# Altium project FOdriver_V2.0.PrjPcb
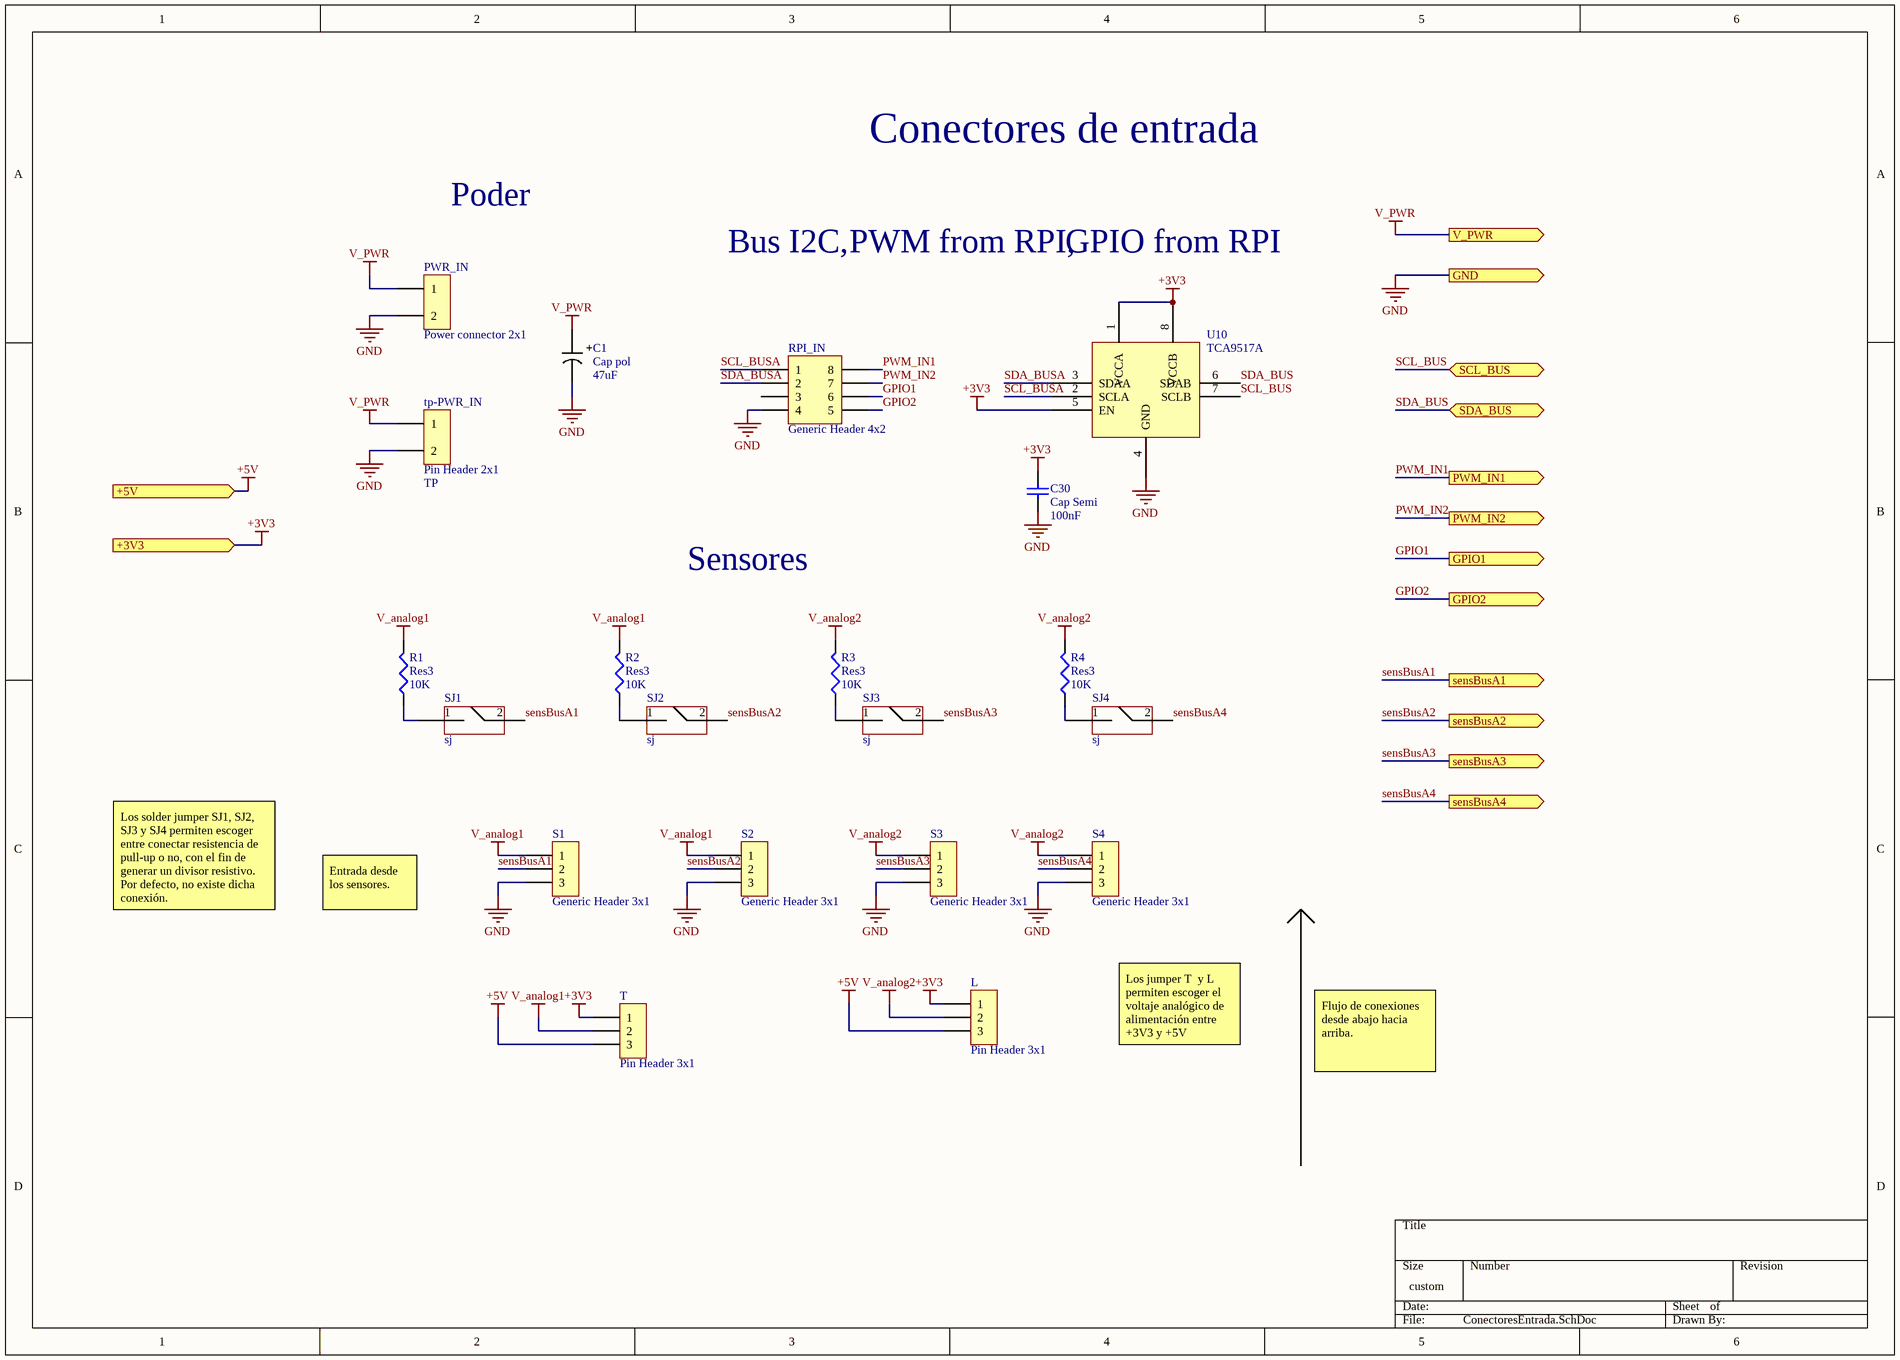
[diagram p0: ConectoresEntrada.SchDoc]
6 sheets, 191 parts. Net scope: hierarchical (ports join the sheet entries above them; power ports are global).
Board file: PCBV2.PcbDoc
Sheets:
  ConectoresEntrada.SchDoc
  DCDC_stepdown.SchDoc
  genPWM.SchDoc
  HighCurrentDriver.SchDoc
  ADC.SchDoc
    1 = analogPath.SchDoc
    2 = analogPath.SchDoc
    3 = analogPath.SchDoc
    4 = analogPath.SchDoc

## Sheet ConectoresEntrada.SchDoc
size 355 x 254 mm; DrawnBy: Constanza Barriga

### Parts
C1  Cap pol  value 47uF  [CAP_SMD_Electrolytic_10x10]
C30  Cap Semi  value 100nF  [1608[0603]]
L  Pin Header 3x1  [HDR-TH_3P-P2.54-V]
PWR_IN  Power connector 2x1  [CONN-TH_430450212]
R1  Res3  value 10K  [J1-0603]
R2  Res3  value 10K  [J1-0603]
R3  Res3  value 10K  [J1-0603]
R4  Res3  value 10K  [J1-0603]
RPI_IN  Generic Header 4x2  [CONN-TH_8P-P2.54-V-M_15477608]
S1  Generic Header 3x1  [CONN-TH_A2547WV-3P]
S2  Generic Header 3x1  [CONN-TH_A2547WV-3P]
S3  Generic Header 3x1  [CONN-TH_A2547WV-3P]
S4  Generic Header 3x1  [CONN-TH_A2547WV-3P]
SJ1  sj  [SJ2]
SJ2  sj  [SJ2]
SJ3  sj  [SJ2]
SJ4  sj  [SJ2]
T  Pin Header 3x1  [HDR-TH_3P-P2.54-V]
tp-PWR_IN  Pin Header 2x1  [HDR-TH_P2.54-H-M_A2541WV-2P]
U10  TCA9517A  [VSSOP - 8]

### Ports
+3V3 (in), +5V (in), GND (out), GPIO1 (out), GPIO2 (out), PWM_IN1 (out), PWM_IN2 (out), SCL_BUS (bidir), SDA_BUS (bidir), sensBusA1 (out), sensBusA2 (out), sensBusA3 (out), sensBusA4 (out), V_PWR (out)

### Nets
+3V3: C30.2 L.1 T.1 U10.1(VCCA) U10.5(EN) U10.8(VCCB) ; port +3V3
+5V: L.3 T.3 ; port +5V
GND: C1.1 C30.1 PWR_IN.2 RPI_IN.4 S1.3 S2.3 S3.3 S4.3 tp-PWR_IN.2 U10.4(GND) ; port GND
V_analog1: R1.2 R2.2 S1.1 S2.1 T.2
V_analog2: L.2 R3.2 R4.2 S3.1 S4.1
V_PWR: C1.2 PWR_IN.1 tp-PWR_IN.1 ; port V_PWR
GPIO1: RPI_IN.6 ; port GPIO1
GPIO2: RPI_IN.5 ; port GPIO2
PWM_IN1: RPI_IN.8 ; port PWM_IN1
PWM_IN2: RPI_IN.7 ; port PWM_IN2
SCL_BUS: U10.7(SCLB) ; port SCL_BUS
SCL_BUSA: RPI_IN.1 U10.2(SCLA)
SDA_BUS: U10.6(SDAB) ; port SDA_BUS
SDA_BUSA: RPI_IN.2 U10.3(SDAA)
sensBusA1: S1.2 SJ1.2 ; port sensBusA1
sensBusA2: S2.2 SJ2.2 ; port sensBusA2
sensBusA3: S3.2 SJ3.2 ; port sensBusA3
sensBusA4: S4.2 SJ4.2 ; port sensBusA4
NetR1_1: R1.1 SJ1.1
NetR2_1: R2.1 SJ2.1
NetR3_1: R3.1 SJ3.1
NetR4_1: R4.1 SJ4.1

Not connected (* = marked no-connect by the designer): RPI_IN 3

### Notes on the sheet
- Conectores de entrada
- Poder
- Bus I2C,
- PWM from RPI,
- GPIO from RPI
- (near tp-PWR_IN) TP
- Sensores
- Los solder jumper SJ1, SJ2, SJ3 y SJ4 permiten escoger entre conectar resistencia de pull-up o no, con el fin de generar un divisor resistivo. Por defecto, no existe dicha conexión.
- Entrada desde los sensores.
- Los jumper T  y L permiten escoger el voltaje analógico de alimentación entre +3V3 y +5V
- Flujo de conexiones desde abajo hacia arriba.
- (in symbol Cap pol) +

### Library data of the parts
C1 = Cap pol: Electrolytic Aluminium Capacitor; Manufacturer: Lelon; Manufacturer Part Number: VEJ470M1HTR-1010; Voltage: 50V; Supplier 1: LCSC; Supplier Part Number 1: C249662; Package: SMD,10x10mm
C30 = Cap Semi: Capacitor (Semiconductor SIM Model); Manufacturer: Taiyo Yuden; Manufacturer Part Number: UMK107B104KAHT; Published: 8-Jun-2000; LatestRevisionDate: 29-May-2009; LatestRevisionNote: IPC-7351 Footprint Added.; PackageReference: C0603; Publisher: Altium Limited; PackageDescription: Chip Capacitor; Supplier 1: LCSC; Supplier Part Number 1: C386152
L T = Header - 3x1c: Pin Header 3pos, 1 row, 2.54 pitch; Manufacturer: CJT(Changjiang Connectors); Manufacturer Part Number: A2541WV-3P; Pitch: 2.54; Supplier 1: LCSC; Supplier Part Number 1: C225478
PWR_IN = PC - 2X1: Generic Header Power 2pos; Manufacturer: MOLEX; Manufacturer Part Number: 430450212; Supplier 1: LCSC; Supplier Part Number 1: C293362; Package: *
R1 R3 = Res3: Resistor; Manufacturer: PANASONIC; Manufacturer Part Number: ERJPB3B1002V; Published: 8-Jun-2000; LatestRevisionDate: 29-May-2009; LatestRevisionNote: IPC-7351 Footprint Added.; PackageReference: J1-0603; Publisher: Altium Limited; PackageDescription: Chip Resistor; Supplier 1: LCSC; Supplier Part Number 1: C161787
R2 = Res3: Resistor; Manufacturer: PANASONIC; Manufacturer Part Number: ERJPB3B1002V; Rule: PcbType=ProtelPcb; Published: 8-Jun-2000; LatestRevisionDate: 29-May-2009; LatestRevisionNote: IPC-7351 Footprint Added.; PackageReference: J1-0603; Publisher: Altium Limited; PackageDescription: Chip Resistor; Supplier 1: LCSC; Supplier Part Number 1: C161787
R4 = Res3: Resistor; Manufacturer Part Number: ERJPB3B1002V; Manufacturer: PANASONIC; Published: 8-Jun-2000; LatestRevisionDate: 29-May-2009; LatestRevisionNote: IPC-7351 Footprint Added.; PackageReference: J1-0603; Publisher: Altium Limited; PackageDescription: Chip Resistor; Supplier Part Number 1: C161787; Supplier 1: LCSC
RPI_IN = Header - 4x2: Generic Header 8 pos, 2 row, 2.54 pitch; Manufacturer: MOLEX; Manufacturer Part Number: 15477608; Pitch: 2.54; Package: Through Hole,P=2.54mm; Supplier 1: LCSC; Supplier part number 1: C277394
S1-S4 = Header - 3x1: Generic Header 3pos, 1 row, 2.54 pitch; Manufacturer: CJT(Changjiang Connectors); Manufacturer Part Number: A2547WV-3P; Pitch: 2.54; Supplier 1: LCSC; Supplier Part Number 1: C239378; Package: Through Hole,P=2.54mm
SJ1-SJ4 = Jumper: solder jumper generic
tp-PWR_IN = Header - 2x1c: Pin Header 2pos, 1 row, 2.54 pitch; Manufacturer: CJT(Changjiang Connectors); Manufacturer Part Number: A2541WV-2P; Pitch: 2.54; Supplier 1: LCSC; Supplier Part Number 1: C225477
U10 = TCA9517A: VSSOP-8_3x3x065P Level Translators, Shifters RoHS; Manufacturer: Texas Instruments; Manufacturer Part Number: TCA9517ADGKR; Supplier 1: LCSC; Supplier Part Number 1: C201698

## Sheet DCDC_stepdown.SchDoc
size 381 x 304 mm; DrawnBy: Constanza Barriga
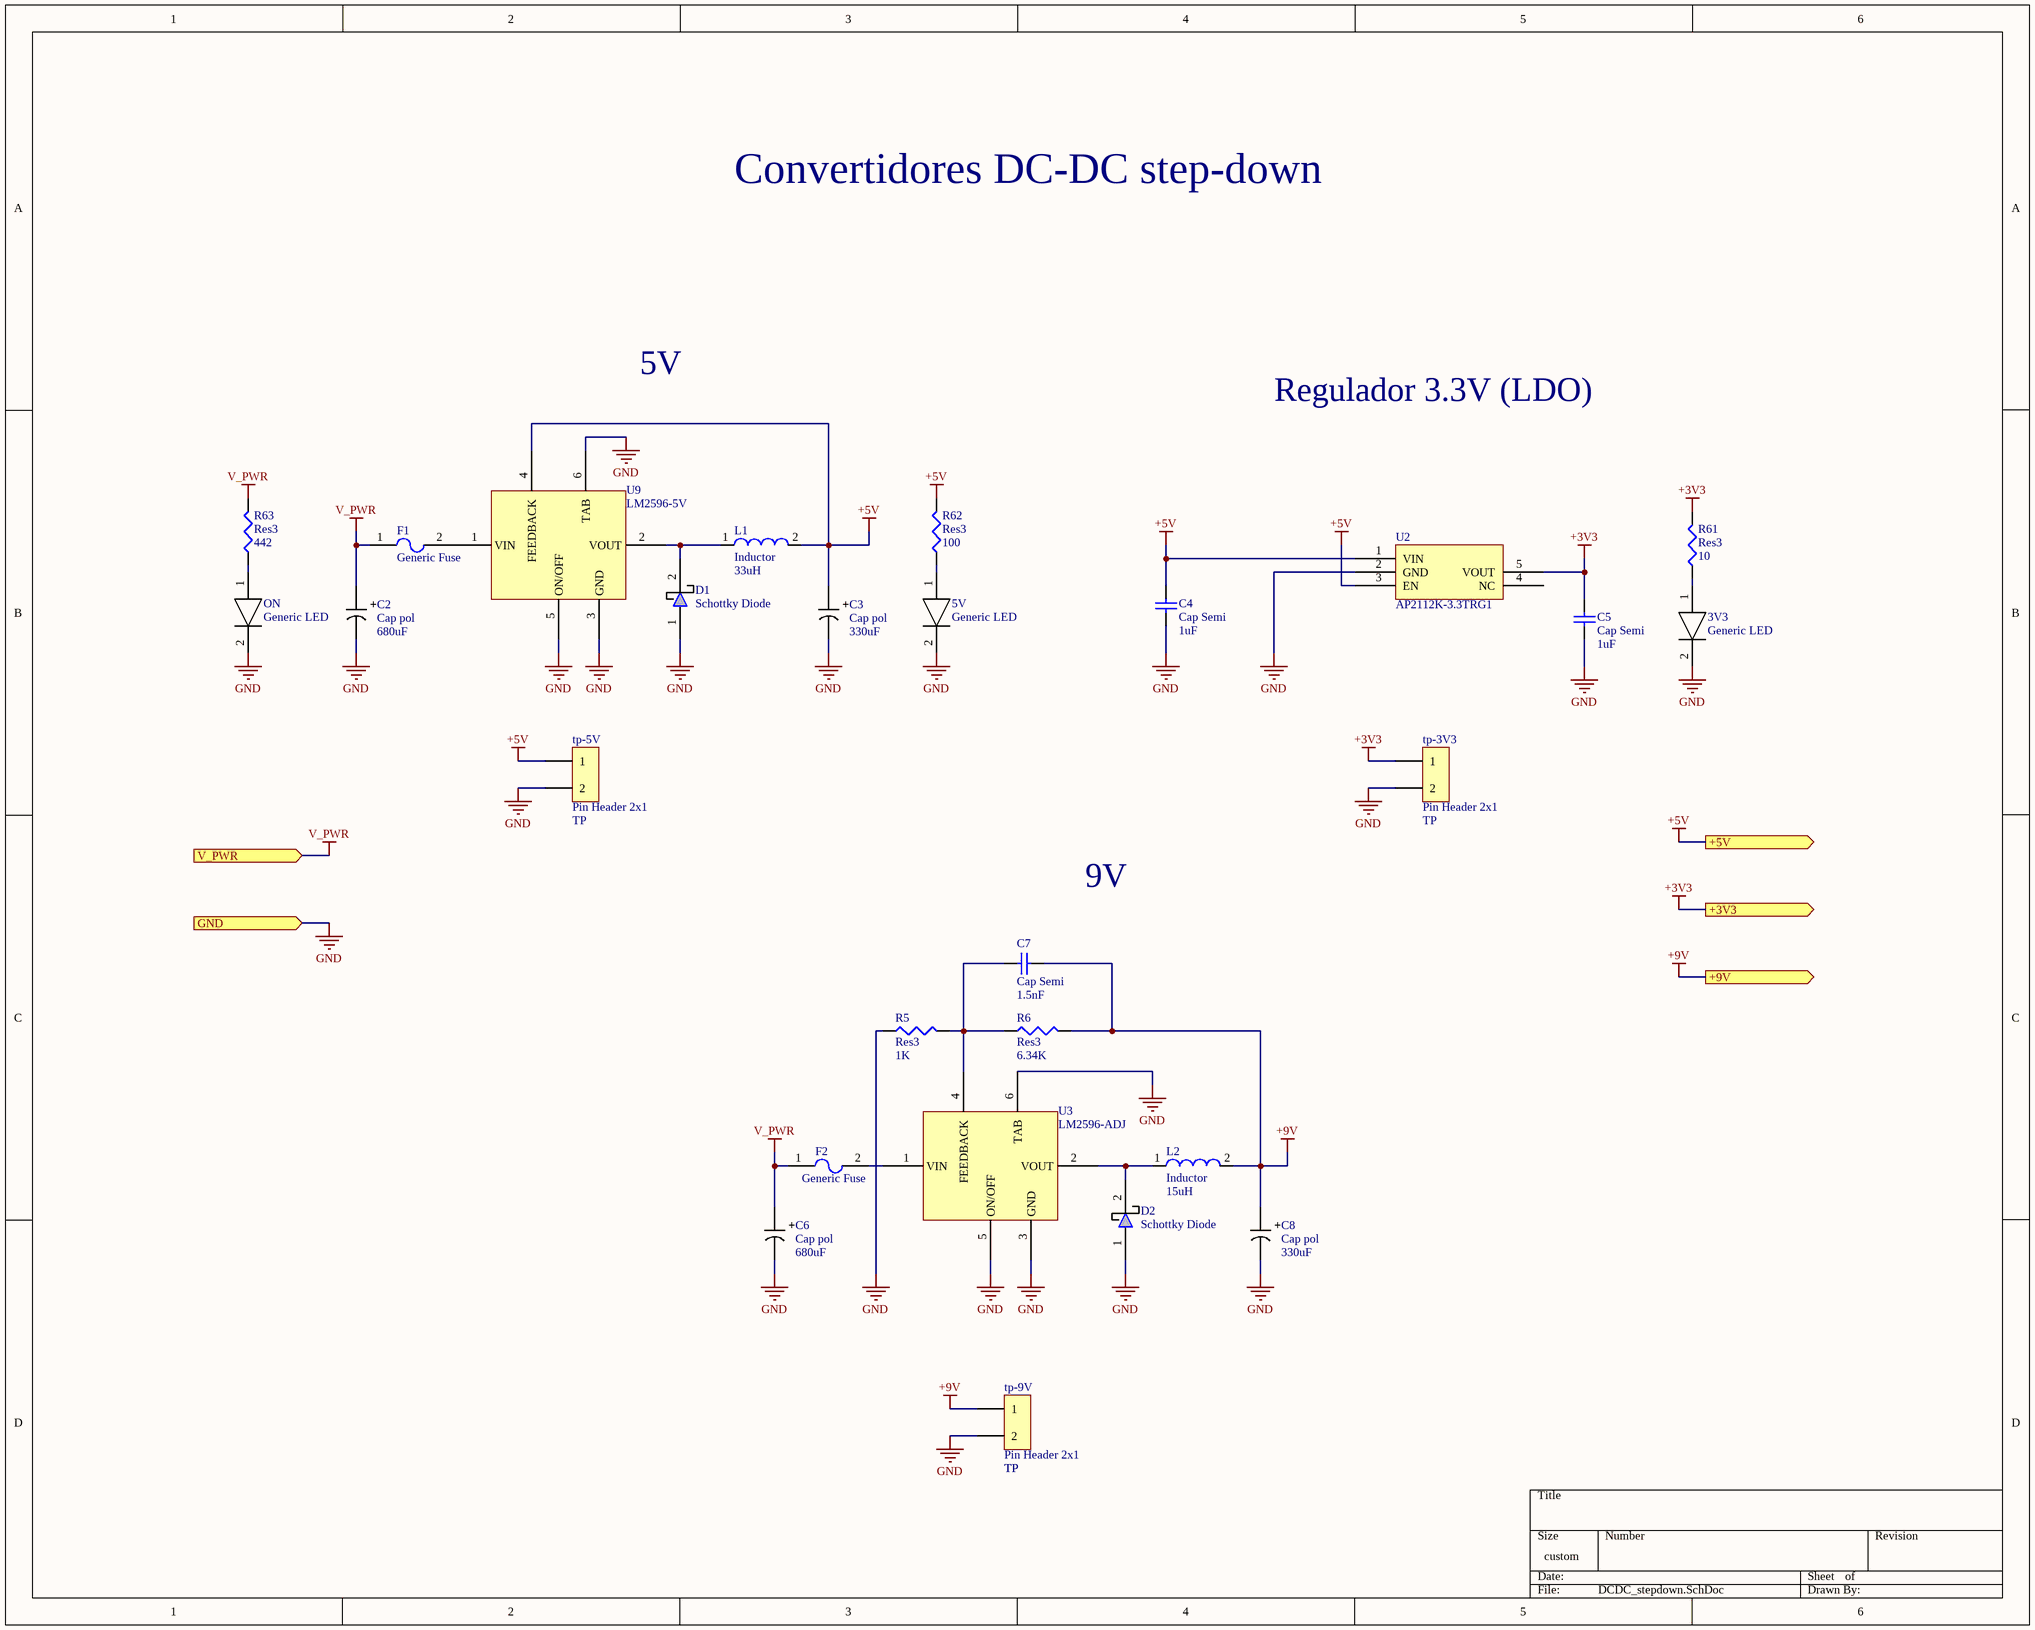
[diagram p1: DCDC_stepdown.SchDoc]

### Parts
3V3  Generic LED  [LED0603]
5V  Generic LED  [LED0603]
C2  Cap pol  value 680uF  [CAP_SMD_Electrolytic_13.5x13.5]
C3  Cap pol  value 330uF  [CAP_SMD_Electrolytic_10x10]
C4  Cap Semi  value 1uF  [1608[0603]]
C5  Cap Semi  value 1uF  [1608[0603]]
C6  Cap pol  value 680uF  [CAP_SMD_Electrolytic_13.5x13.5]
C7  Cap Semi  value 1.5nF  [1608[0603]]
C8  Cap pol  value 330uF  [CAP_SMD_Electrolytic_10x10]
D1  Schottky Diode  [SMB_L4.6-W3.6-LS5.3-RD]
D2  Schottky Diode  [SMB_L4.6-W3.6-LS5.3-RD]
F1  Generic Fuse  [F1206]
F2  Generic Fuse  [F1206]
L1  Inductor  value 33uH  [IND-SMD_L12.5-W12.5_SMDRS1275]
L2  Inductor  value 15uH  [IND-SMD_L8.0-W8.0]
ON  Generic LED  [LED0603]
R5  Res3  value 1K  [J1-0603]
R6  Res3  value 6.34K  [J1-0603]
R61  Res3  value 10  [J1-0603]
R62  Res3  value 100  [J1-0603]
R63  Res3  value 442  [J1-0603]
tp-3V3  Pin Header 2x1  [HDR-TH_P2.54-H-M_A2541WV-2P]
tp-5V  Pin Header 2x1  [HDR-TH_P2.54-H-M_A2541WV-2P]
tp-9V  Pin Header 2x1  [HDR-TH_P2.54-H-M_A2541WV-2P]
U2  AP2112K-3.3TRG1  [SOT25-5]
U3  LM2596-ADJ  [TO-263-5]
U9  LM2596-5V  [TO-263-5]

### Ports
+3V3 (out), +5V (out), +9V (out), GND (in), V_PWR (in)

### Nets
+3V3: C5.2 R61.2 tp-3V3.1 U2.5(VOUT) ; port +3V3
+5V: C3.2 C4.2 L1.2 R62.2 tp-5V.1 U2.1(VIN) U2.3(EN) U9.4(FEEDBACK) ; port +5V
+9V: C7.2 C8.2 L2.2 R6.2 tp-9V.1 ; port +9V
GND: 3V3.2 5V.2 C2.1 C3.1 C4.1 C5.1 C6.1 C8.1 D1.1(+) D2.1(+) ON.2 R5.1 tp-3V3.2 tp-5V.2 tp-9V.2 U2.2(GND) U3.3(GND) U3.5(ON/OFF) U3.6(TAB) U9.3(GND) U9.5(ON/OFF) U9.6(TAB) ; port GND
V_PWR: C2.2 C6.2 F1.1 F2.1 R63.2 ; port V_PWR
Net3V3_1: 3V3.1 R61.1
Net5V_1: 5V.1 R62.1
NetC7_1: C7.1 R5.2 R6.1 U3.4(FEEDBACK)
NetD1_2: D1.2(-) L1.1 U9.2(VOUT)
NetD2_2: D2.2(-) L2.1 U3.2(VOUT)
NetF1_2: F1.2 U9.1(VIN)
NetF2_2: F2.2 U3.1(VIN)
NetON_1: ON.1 R63.1

Not connected (* = marked no-connect by the designer): U2 4(NC)

### Notes on the sheet
- Convertidores DC-DC step-down
- 5V
- Regulador 3.3V (LDO)
- (near tp-5V) TP
- (near tp-3V3) TP
- 9V
- (near tp-9V) TP
- (in symbol Cap pol) +

### Library data of the parts
3V3 5V ON = LED: Generic LED SMD; Manufacturer: Lite-On; Manufacturer Part Number: LTST-C191TGKT; Package: 0603; Color: Green; Supplier 1: LCSC; Supplier Part Number 1: C125101
C2 C6 = Cap pol: Electrolytic Aluminium Capacitor; Manufacturer: PANASONIC; Manufacturer Part Number: EEEFK1V681AQ; Voltage: 35V; Supplier 1: LCSC; Supplier Part Number 1: C178568; Package: SMD,12.5x13.5mm
C3 C8 = Cap pol: Electrolytic Aluminium Capacitor; Manufacturer: PANASONIC; Manufacturer Part Number: EEE1VA331UAP; Voltage: 35V; Supplier 1: LCSC; Supplier Part Number 1: C336488; Package: SMD, 10X10mm
C4 C5 = Cap Semi: Capacitor (Semiconductor SIM Model); Manufacturer: Samsung Electro-Mechanics; Manufacturer Part Number: CL10B105KO8NNNC; Published: 8-Jun-2000; LatestRevisionDate: 29-May-2009; LatestRevisionNote: IPC-7351 Footprint Added.; PackageReference: C0603; Publisher: Altium Limited; PackageDescription: Chip Capacitor; Supplier 1: LCSC; Supplier Part Number 1: C59782
C7 = Cap Semi: Capacitor (Semiconductor SIM Model); Manufacturer: Walsin Tech Corp; Manufacturer Part Number: 0603B152K500; Published: 8-Jun-2000; LatestRevisionDate: 29-May-2009; LatestRevisionNote: IPC-7351 Footprint Added.; PackageReference: C0603; Publisher: Altium Limited; PackageDescription: Chip Capacitor; Supplier 1: LCSC; Supplier Part Number 1: C152947
D1 D2 = Schottky Diode: Schottky Diodes; Manufacturer: MCC(Micro Commercial Components); Manufacturer Part Number: SK32B-LTP; Reverse voltage: 20V; Package: SMB; Supplier 1: LCSC; Supplier Part Number 1: C139945
F1 F2 = FUSE: SMD Fuse; Manufacturer: AEM; Manufacturer Part Number: F1206VH4500TM; Rated Voltage AC: 65V; Current Rating: 4.5A; Supplier 1: LCSC; Supplier Part Number 1: C310980; Package: 1206
L1 = Inductor: Inductor SMD; Manufacturer: GLE; Manufacturer Part Number: GCRH127M-330MC; Supplier 1: LCSC; Supplier Part Number 1: C439422; Package: SMD,12.3x12.3x8mm
L2 = Inductor: Inductor SMD; Manufacturer: 3L COILS; Manufacturer Part Number: SNR8040K-150M; Supplier 1: LCSC; Supplier Part Number 1: C326353; Package: SMD,8.0x8.0mm
R5 = Res3: Resistor; Manufacturer: KAMAYA; Manufacturer Part Number: RMC16K102FTP; Published: 8-Jun-2000; LatestRevisionDate: 29-May-2009; LatestRevisionNote: IPC-7351 Footprint Added.; PackageReference: J1-0603; Publisher: Altium Limited; PackageDescription: Chip Resistor; Supplier 1: LCSC; Supplier Part Number 1: C323557
R6 = Res3: Resistor; Manufacturer: YAGEO; Manufacturer Part Number: RC0603FR-076K34L; Published: 8-Jun-2000; LatestRevisionDate: 29-May-2009; LatestRevisionNote: IPC-7351 Footprint Added.; PackageReference: J1-0603; Publisher: Altium Limited; PackageDescription: Chip Resistor; Supplier 1: LCSC; Supplier Part Number 1: C185314
R61 = Res3: Resistor; Manufacturer Part Number: RC0603FR-0710RL; Manufacturer: YAGEO; Published: 8-Jun-2000; LatestRevisionDate: 29-May-2009; LatestRevisionNote: IPC-7351 Footprint Added.; PackageReference: J1-0603; Publisher: Altium Limited; PackageDescription: Chip Resistor; Supplier 1: LCSC; Supplier Part Number 1: C109318
R62 = Res3: Resistor; Manufacturer Part Number: RC0603FR-07100RL; Manufacturer: YAGEO; Published: 8-Jun-2000; LatestRevisionDate: 29-May-2009; LatestRevisionNote: IPC-7351 Footprint Added.; PackageReference: J1-0603; Publisher: Altium Limited; PackageDescription: Chip Resistor; Supplier 1: LCSC; Supplier Part Number 1: C105588
R63 = Res3: Resistor; Manufacturer Part Number: AC0603FR-07442RL; Manufacturer: YAGEO; Published: 8-Jun-2000; LatestRevisionDate: 29-May-2009; LatestRevisionNote: IPC-7351 Footprint Added.; PackageReference: J1-0603; Publisher: Altium Limited; PackageDescription: Chip Resistor; Supplier 1: LCSC; Supplier Part Number 1: C227905
tp-3V3 tp-5V tp-9V = Header - 2x1c: as tp-PWR_IN on sheet ConectoresEntrada; Supplier 1: LCSC; Supplier Part Number 1: C225477
U2 = AP2112K-3.3: 600mA CMOS LDO REGULATOR WITH ENABLE; Manufacturer: DIODES; Package: SOT-25-5_L3.0-W1.8-P0.95-LS3.0-BL; Supplier 1: LCSC; Supplier Part Number 1: C51118; Manufacturer Part Number: AP2112K-3.3TRG1
U3 = LM2596-ADJ: DC-DC Converters Step-Down Adjustable 1 4.5V 40V 1.2V 37V 3A TO-263-5 RoHS; Manufacturer: Texas Instruments; Manufacturer Part Number: LM2596SX-ADJ/NOPB; Package: TO-263-5; Supplier 1: LCSC; Supplier Part Number 1: C29781
U9 = LM2596-5V: Step-Down Positive Fixed 1 3A 150kHz TO-263-5 DC-DC Converters RoHS; Manufacturer: HTC Korea TAEJIN Tech; Manufacturer Part Number: LM2596R-5.0; Package: TO-263-5; Supplier 1: LCSC; Supplier Part Number 1: C77782

## Sheet genPWM.SchDoc
size 381 x 203 mm
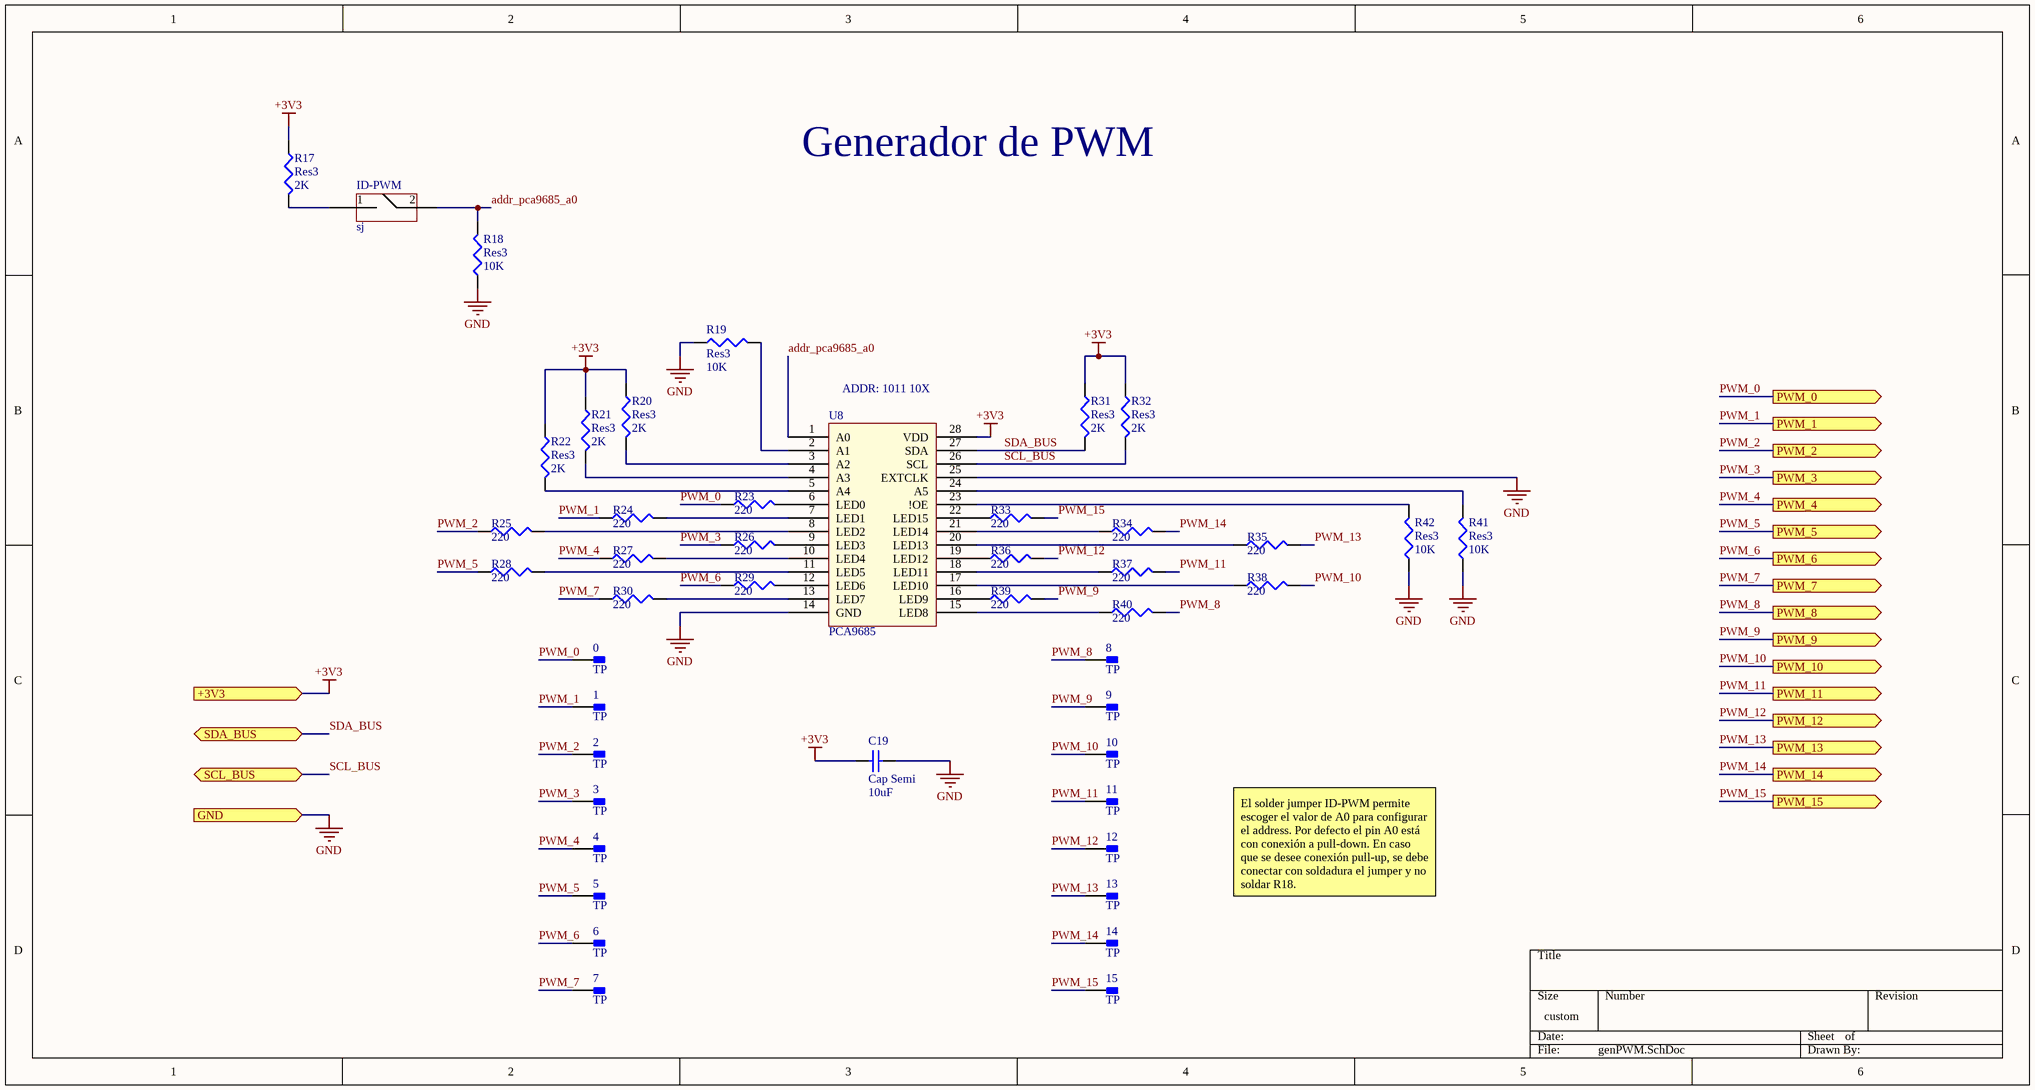
[diagram p2: genPWM.SchDoc]

### Parts
0  TP  [TP]
1  TP  [TP]
2  TP  [TP]
3  TP  [TP]
4  TP  [TP]
5  TP  [TP]
6  TP  [TP]
7  TP  [TP]
8  TP  [TP]
9  TP  [TP]
10  TP  [TP]
11  TP  [TP]
12  TP  [TP]
13  TP  [TP]
14  TP  [TP]
15  TP  [TP]
C19  Cap Semi  value 10uF  [1608[0603]]
ID-PWM  sj  [SJ2]
R17  Res3  value 2K  [J1-0603]
R18  Res3  value 10K  [J1-0603]
R19  Res3  value 10K  [J1-0603]
R20  Res3  value 2K  [J1-0603]
R21  Res3  value 2K  [J1-0603]
R22  Res3  value 2K  [J1-0603]
R23  value 220  [J1-0603]  (hidden comment: Res3)
R24  value 220  [J1-0603]  (hidden comment: Res3)
R25  value 220  [J1-0603]  (hidden comment: Res3)
R26  value 220  [J1-0603]  (hidden comment: Res3)
R27  value 220  [J1-0603]  (hidden comment: Res3)
R28  value 220  [J1-0603]  (hidden comment: Res3)
R29  value 220  [J1-0603]  (hidden comment: Res3)
R30  value 220  [J1-0603]  (hidden comment: Res3)
R31  Res3  value 2K  [J1-0603]
R32  Res3  value 2K  [J1-0603]
R33  value 220  [J1-0603]  (hidden comment: Res3)
R34  value 220  [J1-0603]  (hidden comment: Res3)
R35  value 220  [J1-0603]  (hidden comment: Res3)
R36  value 220  [J1-0603]  (hidden comment: Res3)
R37  value 220  [J1-0603]  (hidden comment: Res3)
R38  value 220  [J1-0603]  (hidden comment: Res3)
R39  value 220  [J1-0603]  (hidden comment: Res3)
R40  value 220  [J1-0603]  (hidden comment: Res3)
R41  Res3  value 10K  [J1-0603]
R42  Res3  value 10K  [J1-0603]
U8  PCA9685  [SSOP-28_L]

### Ports
+3V3 (in), GND (in), PWM_0 (out), PWM_1 (out), PWM_2 (out), PWM_3 (out), PWM_4 (out), PWM_5 (out), PWM_6 (out), PWM_7 (out), PWM_8 (out), PWM_9 (out), PWM_10 (out), PWM_11 (out), PWM_12 (out), PWM_13 (out), PWM_14 (out), PWM_15 (out), SCL_BUS (bidir), SDA_BUS (bidir)

### Nets
+3V3: C19.2 R17.1 R20.1 R21.1 R22.1 R31.1 R32.1 U8.28(VDD) ; port +3V3
GND: C19.1 R18.1 R19.1 R41.1 R42.1 U8.14(GND) U8.25(EXTCLK) ; port GND
addr_pca9685_a0: ID-PWM.2 R18.2 U8.1(A0)
PWM_0: 0.1 R23.1 ; port PWM_0
PWM_1: 1.1 R24.1 ; port PWM_1
PWM_2: 2.1 R25.1 ; port PWM_2
PWM_3: 3.1 R26.1 ; port PWM_3
PWM_4: 4.1 R27.1 ; port PWM_4
PWM_5: 5.1 R28.1 ; port PWM_5
PWM_6: 6.1 R29.1 ; port PWM_6
PWM_7: 7.1 R30.1 ; port PWM_7
PWM_8: 8.1 R40.2 ; port PWM_8
PWM_9: 9.1 R39.2 ; port PWM_9
PWM_10: 10.1 R38.2 ; port PWM_10
PWM_11: 11.1 R37.2 ; port PWM_11
PWM_12: 12.1 R36.2 ; port PWM_12
PWM_13: 13.1 R35.2 ; port PWM_13
PWM_14: 14.1 R34.2 ; port PWM_14
PWM_15: 15.1 R33.2 ; port PWM_15
SCL_BUS: R32.2 U8.26(SCL) ; port SCL_BUS
SDA_BUS: R31.2 U8.27(SDA) ; port SDA_BUS
NetID-PWM_1: ID-PWM.1 R17.2
NetR19_2: R19.2 U8.2(A1)
NetR20_2: R20.2 U8.3(A2)
NetR21_2: R21.2 U8.4(A3)
NetR22_2: R22.2 U8.5(A4)
NetR23_2: R23.2 U8.6(LED0)
NetR24_2: R24.2 U8.7(LED1)
NetR25_2: R25.2 U8.8(LED2)
NetR26_2: R26.2 U8.9(LED3)
NetR27_2: R27.2 U8.10(LED4)
NetR28_2: R28.2 U8.11(LED5)
NetR29_2: R29.2 U8.12(LED6)
NetR30_2: R30.2 U8.13(LED7)
NetR33_1: R33.1 U8.22(LED15)
NetR34_1: R34.1 U8.21(LED14)
NetR35_1: R35.1 U8.20(LED13)
NetR36_1: R36.1 U8.19(LED12)
NetR37_1: R37.1 U8.18(LED11)
NetR38_1: R38.1 U8.17(LED10)
NetR39_1: R39.1 U8.16(LED9)
NetR40_1: R40.1 U8.15(LED8)
NetR41_2: R41.2 U8.24(A5)
NetR42_2: R42.2 U8.23(!OE)

### Notes on the sheet
- Generador de PWM
- (near U8) ADDR: 1011 10X
- El solder jumper ID-PWM permite escoger el valor de A0 para configurar el address. Por defecto el pin A0 está con conexión a pull-down. En caso que se desee conexión pull-up, se debe conectar con soldadura el jumper y no soldar R18.

### Library data of the parts
0-15 = TP: Solder test point
C19 = Cap Semi: Capacitor (Semiconductor SIM Model); Manufacturer: Samsung Electro-Mechanics; Manufacturer Part Number: CL10A106MQ8NNNC; Published: 8-Jun-2000; LatestRevisionDate: 29-May-2009; LatestRevisionNote: IPC-7351 Footprint Added.; PackageReference: C1206; Publisher: Altium Limited; PackageDescription: Chip Capacitor; Supplier 1: LCSC; Supplier Part Number 1: C1691
ID-PWM = Jumper: solder jumper generic
R17 R20-R22 R31 R32 = Res3: Resistor; Manufacturer: YAGEO; Manufacturer Part Number: RC0603FR-072KL; Published: 8-Jun-2000; LatestRevisionDate: 29-May-2009; LatestRevisionNote: IPC-7351 Footprint Added.; PackageReference: J1-0603; Publisher: Altium Limited; PackageDescription: Chip Resistor; Supplier 1: LCSC; Supplier Part Number 1: C105576
R18 R19 R41 R42 = Res3: Resistor; Manufacturer: PANASONIC; Manufacturer Part Number: ERJPA3F1002V; Published: 8-Jun-2000; LatestRevisionDate: 29-May-2009; LatestRevisionNote: IPC-7351 Footprint Added.; PackageReference: J1-0603; Publisher: Altium Limited; PackageDescription: Chip Resistor; Supplier 1: LCSC; Supplier Part Number 1: C441927
R23-R30 R33-R40 = Res3: Resistor; Manufacturer Part Number: RC0603FR-07220RL; Manufacturer: YAGEO; Published: 8-Jun-2000; LatestRevisionDate: 29-May-2009; LatestRevisionNote: IPC-7351 Footprint Added.; PackageReference: J1-0603; Publisher: Altium Limited; PackageDescription: Chip Resistor; Supplier 1: LCSC; Supplier Part Number 1: C107696
U8 = PCA9685: LED Drivers,16CH, I2C, TSSOP-28; Manufacturer: NXP Semicon; Manufacturer Part Number: PCA9685PW/Q900,118; Package: TSSOP-28; Supplier 1: LCSC; Supplier Part Number 1: C92206

## Sheet HighCurrentDriver.SchDoc
size A4
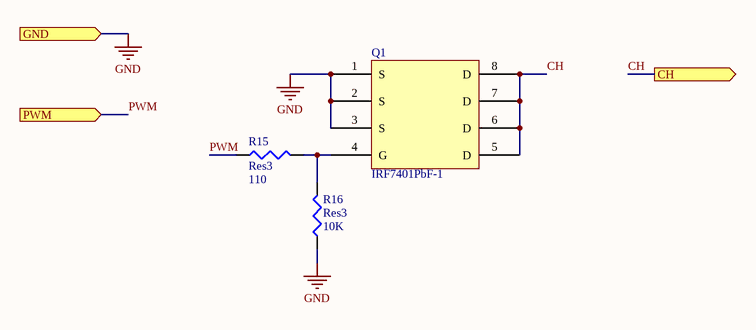
[diagram p3: HighCurrentDriver.SchDoc]

### Parts
Q1  IRF7401PbF-1  [SOIC8]
R15  Res3  value 110  [J1-0603]
R16  Res3  value 10K  [J1-0603]

### Ports
CH (out), GND (in), PWM (in)

### Nets
GND: Q1.1(S) Q1.2(S) Q1.3(S) R16.1 ; port GND
CH: Q1.5(D) Q1.6(D) Q1.7(D) Q1.8(D) ; port CH
PWM: R15.1 ; port PWM
NetQ1_4: Q1.4(G) R15.2 R16.2

### Library data of the parts
Q1 = IRF7401: MOSFET N Channel 20V 8.7A 700mV @ 250uA 22mΩ @ 4.1A,4.5V SOIC-8_150mil RoHS; Manufacturer: Infineon Technologies; Manufacturer Part Number: IRF7401TRPBF; Package: SO-8; Supplier 1: LCSC; Supplier Part Number 1: C169092
R15 = Res3: Resistor; Manufacturer: ROHM Semicon; Manufacturer Part Number: MCR03EZPFX1100; Published: 8-Jun-2000; LatestRevisionDate: 29-May-2009; LatestRevisionNote: IPC-7351 Footprint Added.; PackageReference: J1-0603; Publisher: Altium Limited; PackageDescription: Chip Resistor; Supplier 1: LCSC; Supplier Part Number 1: C308180
R16 = Res3: as R18 on sheet genPWM; Published: 8-Jun-2000; LatestRevisionDate: 29-May-2009; LatestRevisionNote: IPC-7351 Footprint Added.; PackageReference: J1-0603; Publisher: Altium Limited; PackageDescription: Chip Resistor; Supplier 1: LCSC; Supplier Part Number 1: C441927

## Sheet ADC.SchDoc
size 381 x 254 mm
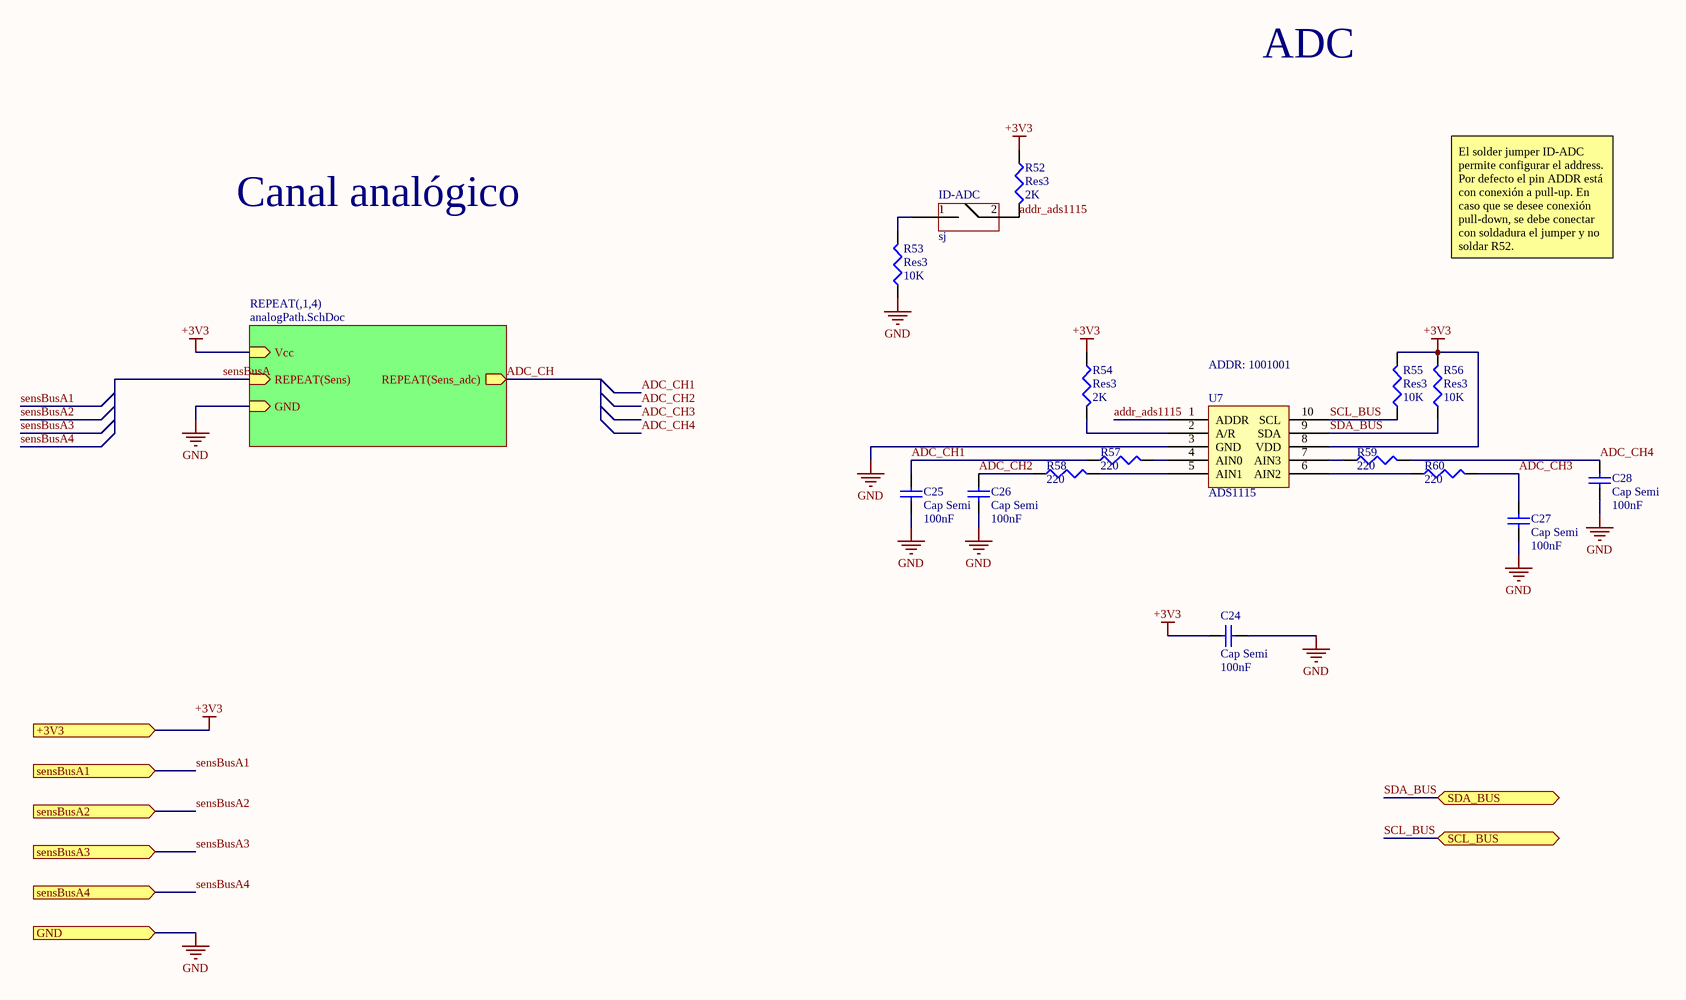
[diagram p4: ADC.SchDoc]

### Parts
C24  Cap Semi  value 100nF  [1608[0603]]
C25  Cap Semi  value 100nF  [1608[0603]]
C26  Cap Semi  value 100nF  [1608[0603]]
C27  Cap Semi  value 100nF  [1608[0603]]
C28  Cap Semi  value 100nF  [1608[0603]]
ID-ADC  sj  [SJ2]
R52  Res3  value 2K  [J1-0603]
R53  Res3  value 10K  [J1-0603]
R54  Res3  value 2K  [J1-0603]
R55  Res3  value 10K  [J1-0603]
R56  Res3  value 10K  [J1-0603]
R57  value 220  [J1-0603]  (hidden comment: Res3)
R58  value 220  [J1-0603]  (hidden comment: Res3)
R59  value 220  [J1-0603]  (hidden comment: Res3)
R60  value 220  [J1-0603]  (hidden comment: Res3)
U7  ADS1115  [VSSOP - 10]

### Sub-sheets
REPEAT(,1,4) = analogPath.SchDoc: Vcc (in), REPEAT(Sens) (in), GND (in), REPEAT(Sens_adc) (out)

### Ports
+3V3 (in), GND (in), SCL_BUS (bidir), SDA_BUS (bidir), sensBusA1 (in), sensBusA2 (in), sensBusA3 (in), sensBusA4 (in)

### Nets
+3V3: C24.2 R52.1 R54.1 R55.2 R56.2 U7.8(VDD) ; port +3V3, sheet REPEAT(,1,4)/Vcc
GND: C24.1 C25.1 C26.1 C27.1 C28.1 R53.1 U7.3(GND) ; port GND, sheet REPEAT(,1,4)/GND
ADC_CH: sheet REPEAT(,1,4)/REPEAT(Sens_adc)
ADC_CH1: C25.2 R57.1
ADC_CH2: C26.2 R58.1
ADC_CH3: C27.2 R60.2
ADC_CH4: C28.2 R59.2
addr_ads1115: ID-ADC.2 R52.2 U7.1(ADDR)
SCL_BUS: R55.1 U7.10(SCL) ; port SCL_BUS
SDA_BUS: R56.1 U7.9(SDA) ; port SDA_BUS
sensBusA: sheet REPEAT(,1,4)/REPEAT(Sens)
NetID-ADC_1: ID-ADC.1 R53.2
NetR54_2: R54.2 U7.2(A/R)
NetR57_2: R57.2 U7.4(AIN0)
NetR58_2: R58.2 U7.5(AIN1)
NetR59_1: R59.1 U7.7(AIN3)
NetR60_1: R60.1 U7.6(AIN2)

### Notes on the sheet
- ADC
- Canal analógico
- El solder jumper ID-ADC permite configurar el address. Por defecto el pin ADDR está con conexión a pull-up. En caso que se desee conexión pull-down, se debe conectar con soldadura el jumper y no soldar R52.
- (near U7) ADDR: 1001001

### Library data of the parts
C24 C26 C28 = Cap Semi: as C30 on sheet ConectoresEntrada; Published: 8-Jun-2000; LatestRevisionDate: 29-May-2009; LatestRevisionNote: IPC-7351 Footprint Added.; PackageReference: C0603; Publisher: Altium Limited; PackageDescription: Chip Capacitor; Supplier 1: LCSC; Supplier Part Number 1: C386152
C25 C27 = Cap Semi: Capacitor (Semiconductor SIM Model); Manufacturer Part Number: UMK107B104KAHT; Manufacturer: Taiyo Yuden; Published: 8-Jun-2000; LatestRevisionDate: 29-May-2009; LatestRevisionNote: IPC-7351 Footprint Added.; PackageReference: C0603; Publisher: Altium Limited; PackageDescription: Chip Capacitor; Supplier 1: LCSC; Supplier Part Number 1: C386152
ID-ADC = Jumper: solder jumper generic
R52 R54 = Res3: as R17 on sheet genPWM; Published: 8-Jun-2000; LatestRevisionDate: 29-May-2009; LatestRevisionNote: IPC-7351 Footprint Added.; PackageReference: J1-0603; Publisher: Altium Limited; PackageDescription: Chip Resistor; Supplier 1: LCSC; Supplier Part Number 1: C105576
R53 R55 R56 = Res3: as R18 on sheet genPWM; Published: 8-Jun-2000; LatestRevisionDate: 29-May-2009; LatestRevisionNote: IPC-7351 Footprint Added.; PackageReference: J1-0603; Publisher: Altium Limited; PackageDescription: Chip Resistor; Supplier 1: LCSC; Supplier Part Number 1: C441927
R57-R60 = Res3: as R23 on sheet genPWM; Published: 8-Jun-2000; LatestRevisionDate: 29-May-2009; LatestRevisionNote: IPC-7351 Footprint Added.; PackageReference: J1-0603; Publisher: Altium Limited; PackageDescription: Chip Resistor; Supplier 1: LCSC; Supplier Part Number 1: C107696
U7 = ADS1115QDGSRQ1: Analog To Digital Converters (ADCs) VSSOP-10 RoHS; Manufacturer: Texas Instruments; Supplier 1: LCSC; Supplier Part Number 1: C172375; Manufacturer Part Number: ADS1115QDGSRQ1; Package: VSSOP-10

## Sheet analogPath.SchDoc
size 381 x 241 mm
Used 4 times, as channels 1, 2, 3, 4. Parts and nets are listed once, with the designators drawn on the sheet.
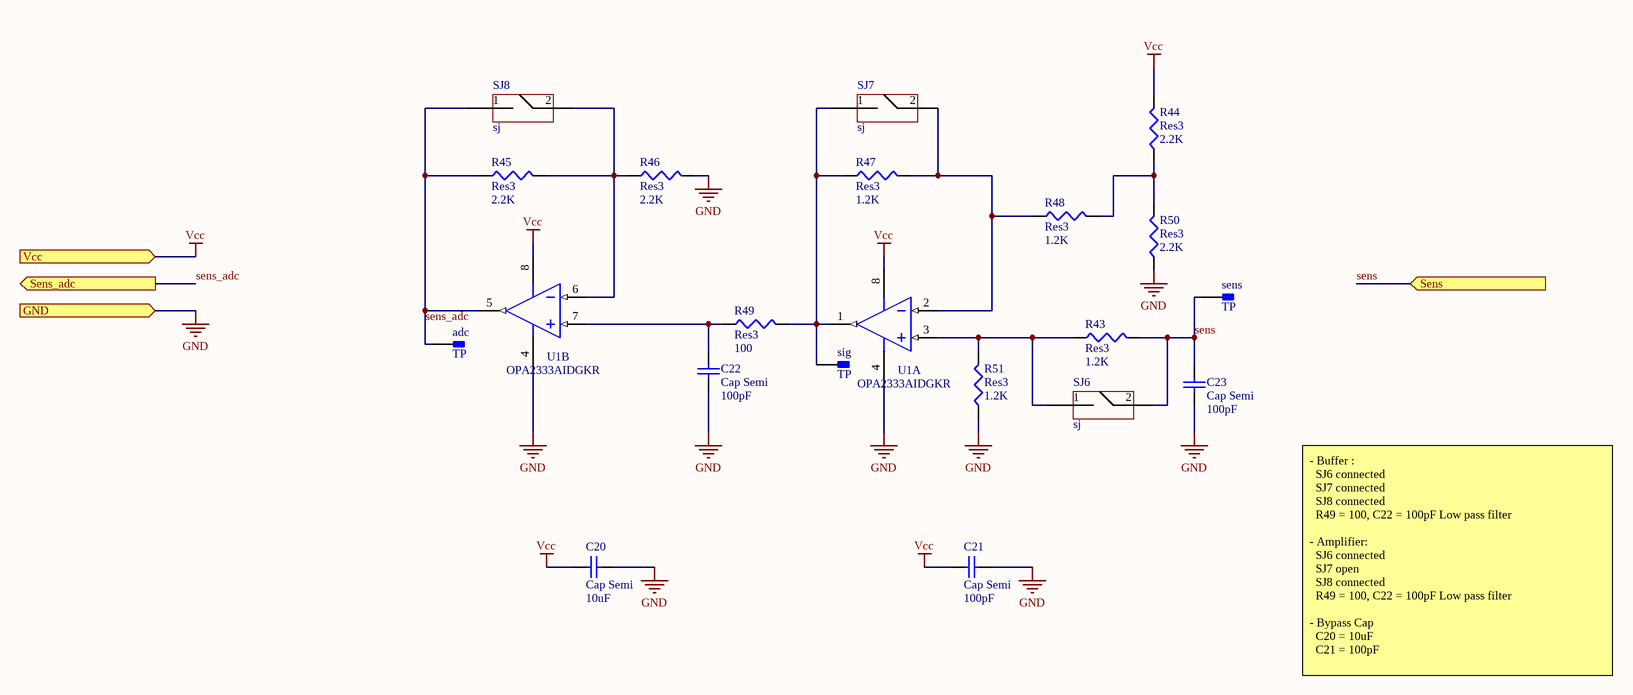
[diagram p5: analogPath.SchDoc]

### Parts
adc  TP  [TP]
C20  Cap Semi  value 10uF  [1608[0603]]
C21  Cap Semi  value 100pF  [1608[0603]]
C22  Cap Semi  value 100pF  [1608[0603]]
C23  Cap Semi  value 100pF  [1608[0603]]
R43  Res3  value 1.2K  [J1-0603]
R44  Res3  value 2.2K  [J1-0603]
R45  Res3  value 2.2K  [J1-0603]
R46  Res3  value 2.2K  [J1-0603]
R47  Res3  value 1.2K  [J1-0603]
R48  Res3  value 1.2K  [J1-0603]
R49  Res3  value 100  [J1-0603]
R50  Res3  value 2.2K  [J1-0603]
R51  Res3  value 1.2K  [J1-0603]
sens  TP  [TP]
sig  TP  [TP]
SJ6  sj  [SJ2]
SJ7  sj  [SJ2]
SJ8  sj  [SJ2]
U1  OPA2333AIDGKR  [MSOP-8]  (parts A,B of 2)

### Ports
GND (in), Sens (in), Sens_adc (out), Vcc (in)

### Nets
GND: C20.1 C21.2 C22.1 C23.1 R46.2 R50.1 R51.1 U1.4(-V) ; port GND
Vcc: C20.2 C21.1 R44.2 U1.8(+V) ; port Vcc
sens: C23.2 R43.2 sens.1 SJ6.2 ; port Sens
sens_adc: adc.1 R45.1 SJ8.1 U1.5(OUT_A) ; port Sens_adc
NetC22_2: C22.2 R49.1 U1.7(+IN_A)
NetR43_1: R43.1 R51.2 SJ6.1 U1.3(+IN_A)
NetR44_1: R44.1 R48.2 R50.2
NetR45_2: R45.2 R46.1 SJ8.2 U1.6(-IN_A)
NetR47_1: R47.1 R49.2 sig.1 SJ7.1 U1.1(OUT_A)
NetR47_2: R47.2 R48.1 SJ7.2 U1.2(-IN_A)

### Channels
1: designators end in _1; ports GND=GND Sens=sens_1 Sens_adc=ADC_CH1 Vcc=+3V3
2: designators end in _2; ports GND=GND Sens=sens_2 Sens_adc=ADC_CH2 Vcc=+3V3
3: designators end in _3; ports GND=GND Sens=sens_3 Sens_adc=ADC_CH3 Vcc=+3V3
4: designators end in _4; ports GND=GND Sens=sens_4 Sens_adc=ADC_CH4 Vcc=+3V3

### Notes on the sheet
- - Buffer :
  SJ6 connected
  SJ7 connected
  SJ8 connected
  R49 = 100, C22 = 100pF Low pass filter
  - Amplifier:
  SJ6 connected
  SJ7 open
  SJ8 connected
  R49 = 100, C22 = 100pF Low pass filter
  - Bypass Cap
  C20 = 10uF
  C21 = 100pF

### Library data of the parts
adc sens sig = TP: Solder test point
C20 = Cap Semi: as C19 on sheet genPWM; Published: 8-Jun-2000; LatestRevisionDate: 29-May-2009; LatestRevisionNote: IPC-7351 Footprint Added.; PackageReference: C1206; Publisher: Altium Limited; PackageDescription: Chip Capacitor; Supplier 1: LCSC; Supplier Part Number 1: C1691
C21-C23 = Cap Semi: Capacitor (Semiconductor SIM Model); Manufacturer: YAGEO; Manufacturer Part Number: CC0603KRX7R8BB101; Published: 8-Jun-2000; LatestRevisionDate: 29-May-2009; LatestRevisionNote: IPC-7351 Footprint Added.; PackageReference: C0603; Publisher: Altium Limited; PackageDescription: Chip Capacitor; Supplier 1: LCSC; Supplier Part Number 1: C519410
R43 R47 R48 R51 = Res3: Resistor; Manufacturer Part Number: MCR03EZPFX1201; Manufacturer: ROHM Semicon; Published: 8-Jun-2000; LatestRevisionDate: 29-May-2009; LatestRevisionNote: IPC-7351 Footprint Added.; PackageReference: J1-0603; Publisher: Altium Limited; PackageDescription: Chip Resistor; Supplier Part Number 1: C380376; Supplier 1: LCSC
R44-R46 R50 = Res3: Resistor; Manufacturer Part Number: RC0603FR-072K2L; Manufacturer: YAGEO; Published: 8-Jun-2000; LatestRevisionDate: 29-May-2009; LatestRevisionNote: IPC-7351 Footprint Added.; PackageReference: J1-0603; Publisher: Altium Limited; PackageDescription: Chip Resistor; Supplier 1: LCSC; Supplier Part Number 1: C114662
R49 = Res3: as R62 on sheet DCDC_stepdown; Published: 8-Jun-2000; LatestRevisionDate: 29-May-2009; LatestRevisionNote: IPC-7351 Footprint Added.; PackageReference: J1-0603; Publisher: Altium Limited; PackageDescription: Chip Resistor; Supplier 1: LCSC; Supplier Part Number 1: C105588
SJ6-SJ8 = Jumper: solder jumper generic
U1 = OPA2333: Precision OpAmps Zero-Drift 2 1.8V ~ 5.5V, ±0.9V ~ 2.75V 350kHz 0.16 V/us MSOP-8 RoHS; Manufacturer: Texas Instruments; Supplier 1: LCSC; Supplier Part Number 1: C19608; Manufacturer Part Number: OPA2333AIDGKR

## Nets that join several sheets
+3V3: ConectoresEntrada (6 pins), DCDC_stepdown (C5.2 R61.2 tp-3V3.1 U2.5), genPWM (8 pins), ADC (6 pins), 1 (C20_1.2 C21_1.1 R44_1.2 U1_1.8), 2 (C20_2.2 C21_2.1 R44_2.2 U1_2.8), 3 (C20_3.2 C21_3.1 R44_3.2 U1_3.8), 4 (C20_4.2 C21_4.1 R44_4.2 U1_4.8)
+5V: ConectoresEntrada (L.3 T.3), DCDC_stepdown (8 pins)
GND: ConectoresEntrada (10 pins), DCDC_stepdown (22 pins), genPWM (7 pins), HighCurrentDriver (Q1.1 Q1.2 Q1.3 R16.1), ADC (7 pins), 1 (8 pins), 2 (8 pins), 3 (8 pins), 4 (8 pins)
V_PWR: ConectoresEntrada (C1.2 PWR_IN.1 tp-PWR_IN.1), DCDC_stepdown (5 pins)
ADC_CH1: ADC (C25.2 R57.1), 1 (adc_1.1 R45_1.1 SJ8_1.1 U1_1.5)
ADC_CH2: ADC (C26.2 R58.1), 2 (adc_2.1 R45_2.1 SJ8_2.1 U1_2.5)
ADC_CH3: ADC (C27.2 R60.2), 3 (adc_3.1 R45_3.1 SJ8_3.1 U1_3.5)
ADC_CH4: ADC (C28.2 R59.2), 4 (adc_4.1 R45_4.1 SJ8_4.1 U1_4.5)